# Altium schematic sheet Sheet1.SchDoc
size A
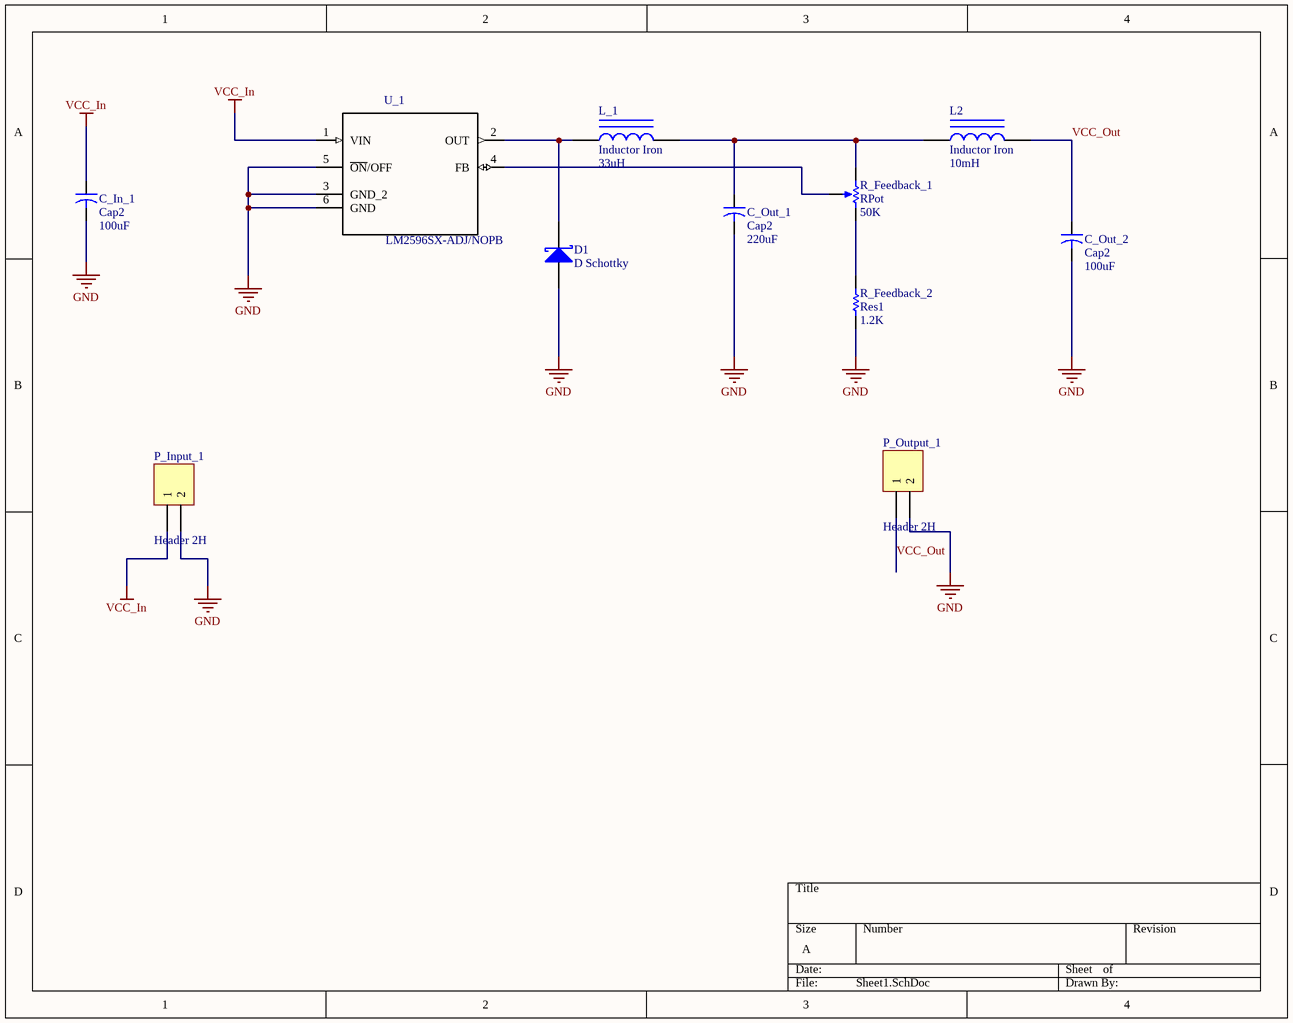
[diagram p0: Sheet1.SchDoc]

## Parts
C_In_1  Cap2  value 100uF  [CAPR5-4X5]
C_Out_1  Cap2  value 220uF  [CAPR5-4X5]
C_Out_2  Cap2  value 100uF  [CAPR5-4X5]
D1  D Schottky  [SMB]
L2  Inductor Iron  value 10mH  [AXIAL-0.9]
L_1  Inductor Iron  value 33uH  [AXIAL-0.9]
P_Input_1  Header 2H  [HDR1X2H]
P_Output_1  Header 2H  [HDR1X2H]
R_Feedback_1  RPot  value 50K  [VR5]
R_Feedback_2  Res1  value 1.2K  [AXIAL-0.3]
U_1  LM2596SX-ADJ/NOPB  [TO170P1435X465-6N]

## Nets
GND: C_In_1.2 C_Out_1.2 C_Out_2.2 D1.1(A) P_Input_1.2 P_Output_1.2 R_Feedback_2.1 U_1.3(GND_2) U_1.5(~{ON}/OFF) U_1.6(GND)
VCC_In: C_In_1.1 P_Input_1.1 U_1.1(VIN)
VCC_Out: C_Out_2.1 L2.2 P_Output_1.1
NetC_Out_1_1: C_Out_1.1 L2.1 L_1.2 R_Feedback_1.1(TOP)
NetD1_2: D1.2(K) L_1.1 U_1.2(OUT)
NetR_Feedback_1_2: R_Feedback_1.2(BOT) R_Feedback_2.2
NetR_Feedback_1_3: R_Feedback_1.3(TAP) U_1.4(FB)

## Library data of the parts
C_In_1 C_Out_1 C_Out_2 = Cap2: Capacitor; Published: 23-Sep-2002; PackageReference: CAPR5-4X5; Publisher: Altium Limited; PackageDescription: Capacitor; 2 Leads
D1 = D Schottky: Schottky Diode; Published: 8-Jun-2000; LatestRevisionDate: 17-Jul-2002; LatestRevisionNote: Re-released for DXP Platform.; PackageReference: SMB; Publisher: Altium Limited; PackageDescription: DO-214-AA/SMB; 2 C-Bend Leads; Body 5.3 x 3.6 mm, inc. leads (LxW); Code_JEDEC: DO-214-AA
L2 L_1 = Inductor Iron: Magnetic-Core Inductor; Published: 24-Mar-1999; LatestRevisionDate: 17-Jul-2002; LatestRevisionNote: Re-released for DXP Platform.; PackageReference: AXIAL-0.9; Publisher: Altium Limited; PackageDescription: Axial Device, Thru-Hole; 2 Leads; 0.9 in Pin Spacing
P_Input_1 P_Output_1 = Header 2H: Header, 2-Pin, Right Angle; LatestRevisionDate: 17-Jul-2002; LatestRevisionNote: Re-released for DXP Platform.; Publisher: Altium Limited
R_Feedback_1 = RPot: Potentiometer; Sim Note: Enter the Resistance value and the set point into parameter fields.; Set Position: 0.5; Published: 8-Jun-2000; LatestRevisionDate: 17-Jul-2002; LatestRevisionNote: Re-released for DXP Platform.; PackageReference: VR5; Publisher: Altium Limited; PackageDescription: Variable Resistor, Thru-Hole; 3 Leads
R_Feedback_2 = Res1: Resistor; Published: 8-Jun-2000; LatestRevisionDate: 17-Jul-2002; LatestRevisionNote: Re-released for DXP Platform.; PackageReference: AXIAL-0.3; Publisher: Altium Limited; PackageDescription: Axial Device, Thru-Hole; 2 Leads; 0.3 in Pin Spacing
U_1 = LM2596SX-ADJ/NOPB: SIMPLE SWITCHER® 4.5V to 40V, 3A Low Component Count Step-Down Regulator 5-DDPAK/TO-263 -40 to 125; MF: Texas Instruments; Price: None; Package: TO-263-6 Texas Instruments; SnapEDA_Link: https://www.snapeda.com/parts/LM2596SX-ADJ/NOPB/Texas%20Instruments/view-part/?ref=snap; Availability: Unavailable; MP: LM2596SX-ADJ/NOPB; Value: *